# EasyEDA schematic SCH_u2-SX Mini2 - AC608 IO Board v0.1_2024-04-02.json

## Sheets
1 Core: TITLE: Sheet_1; REV: 1.0; Date: 2024-03-23; Sheet: 1/1; Drawn By: Denjhang; Company: Your Company
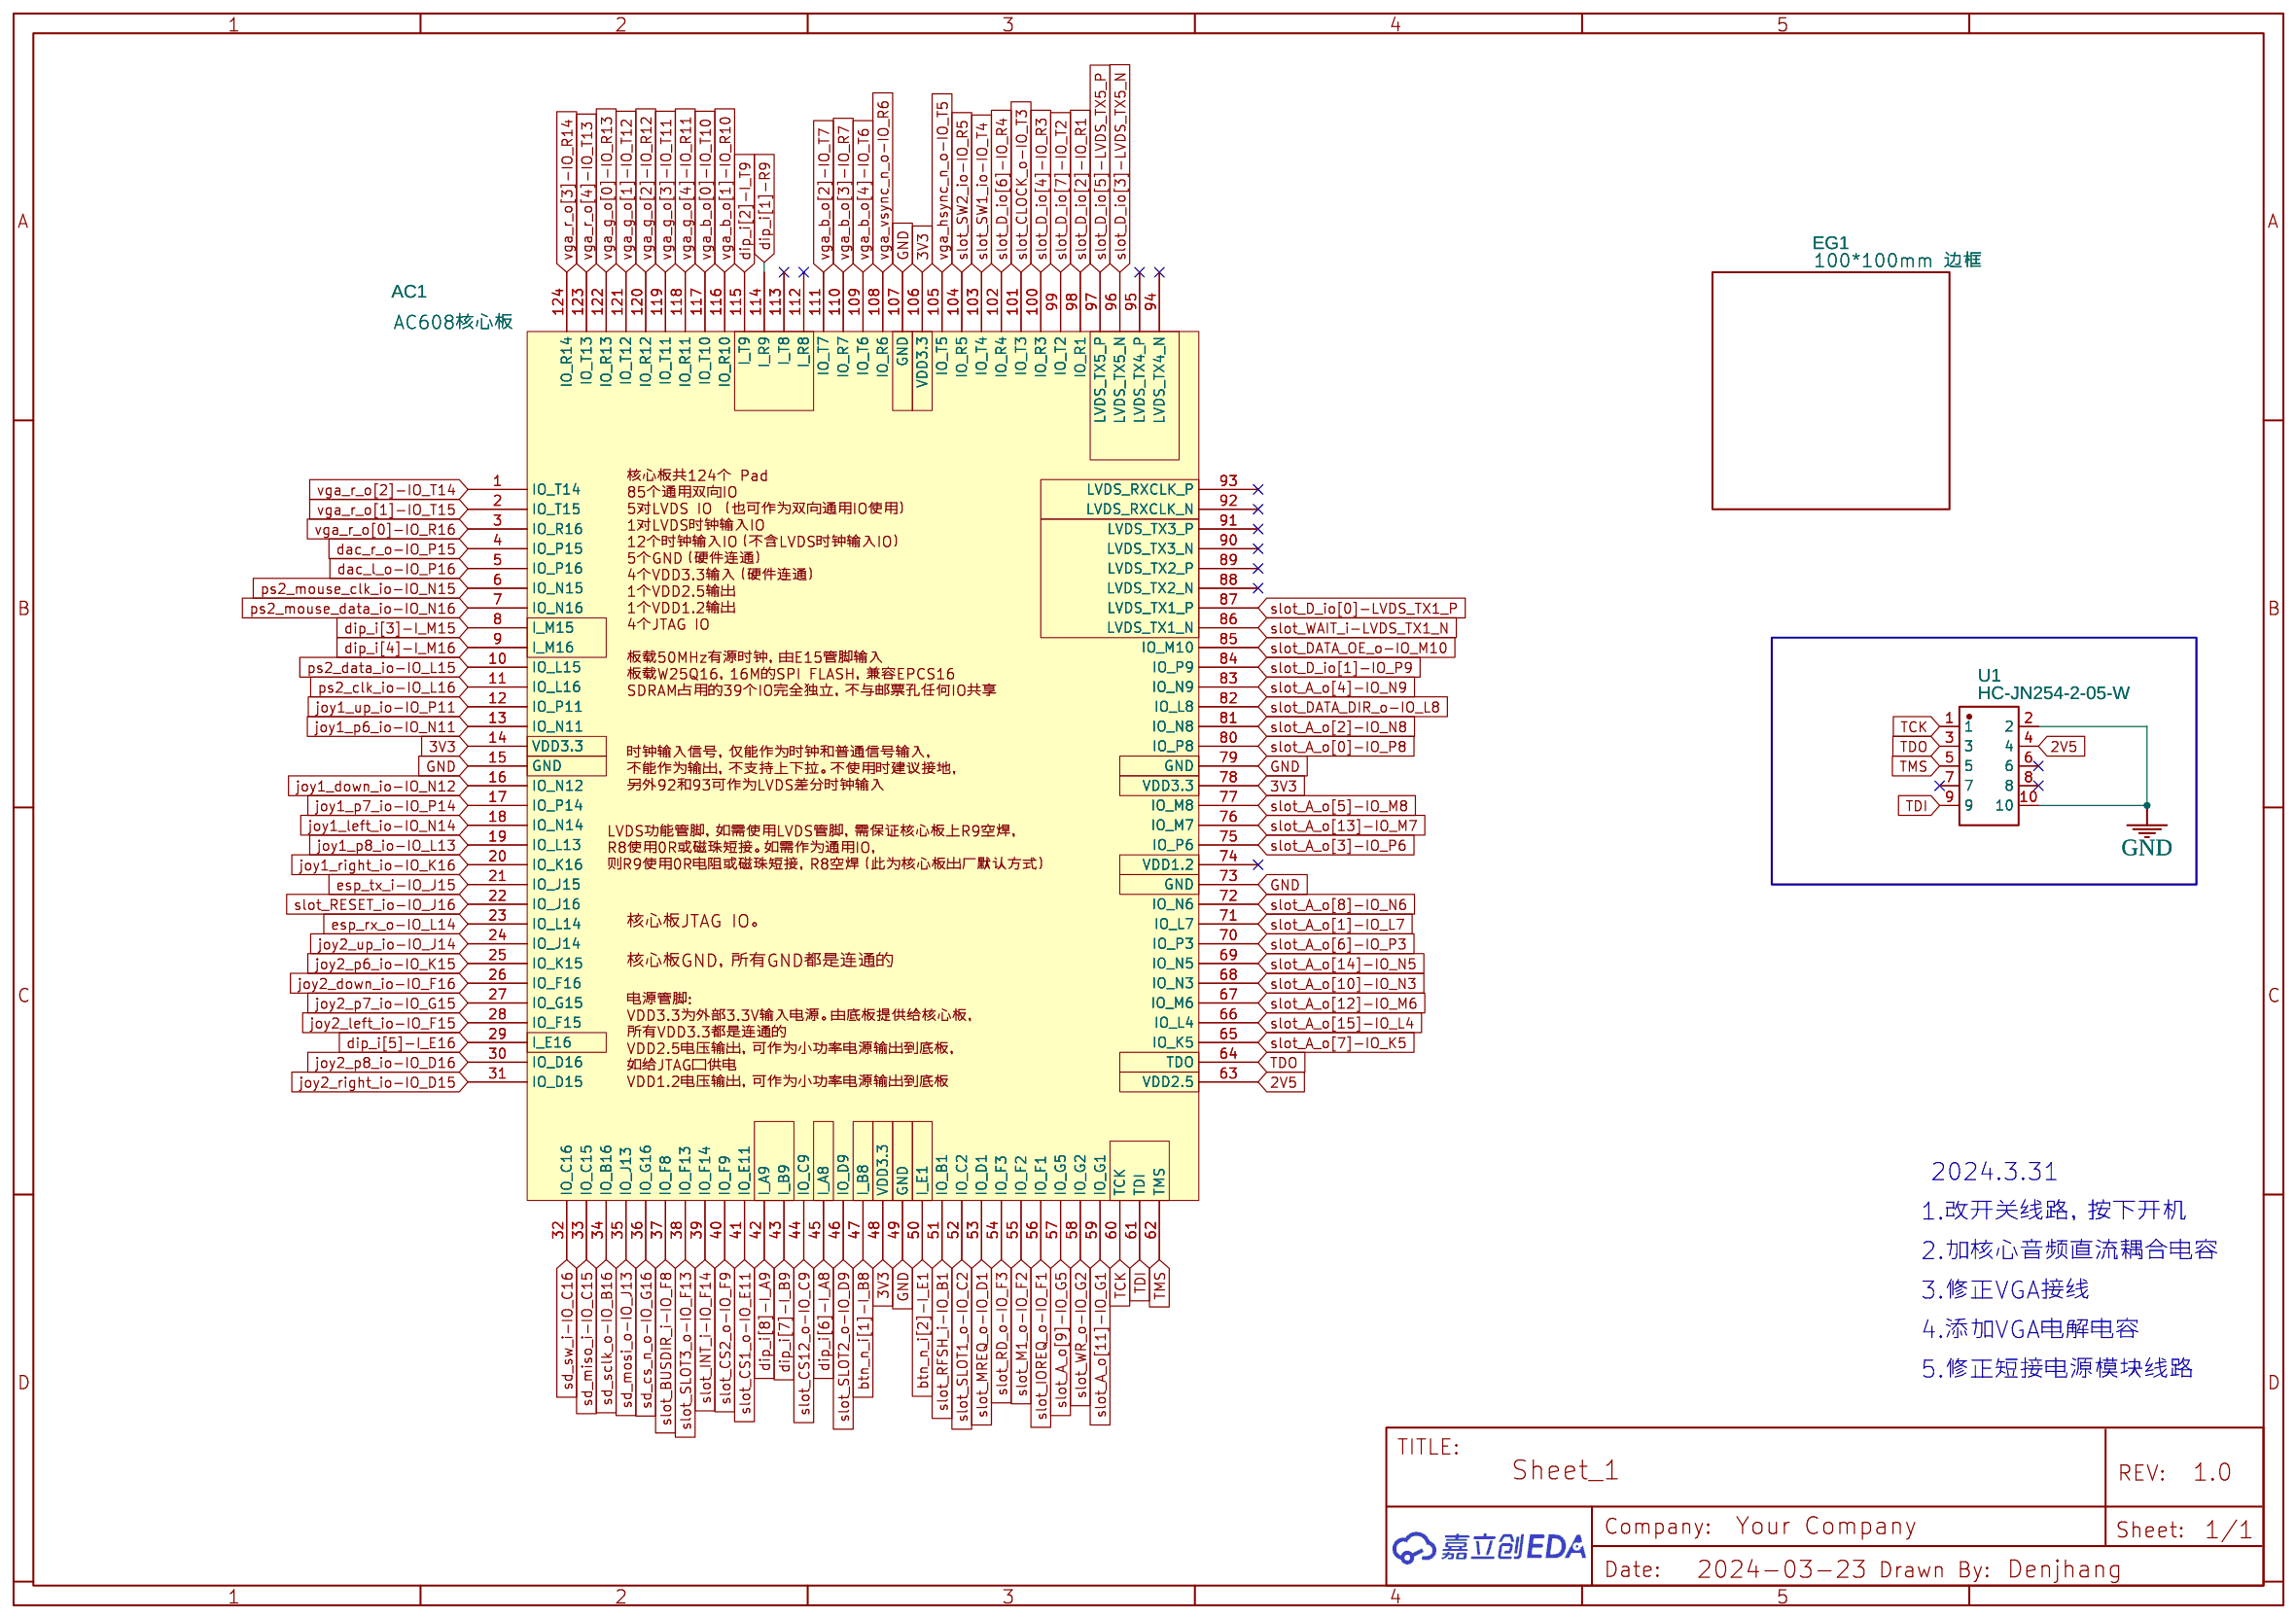
[diagram p0: Core]
2 PSU
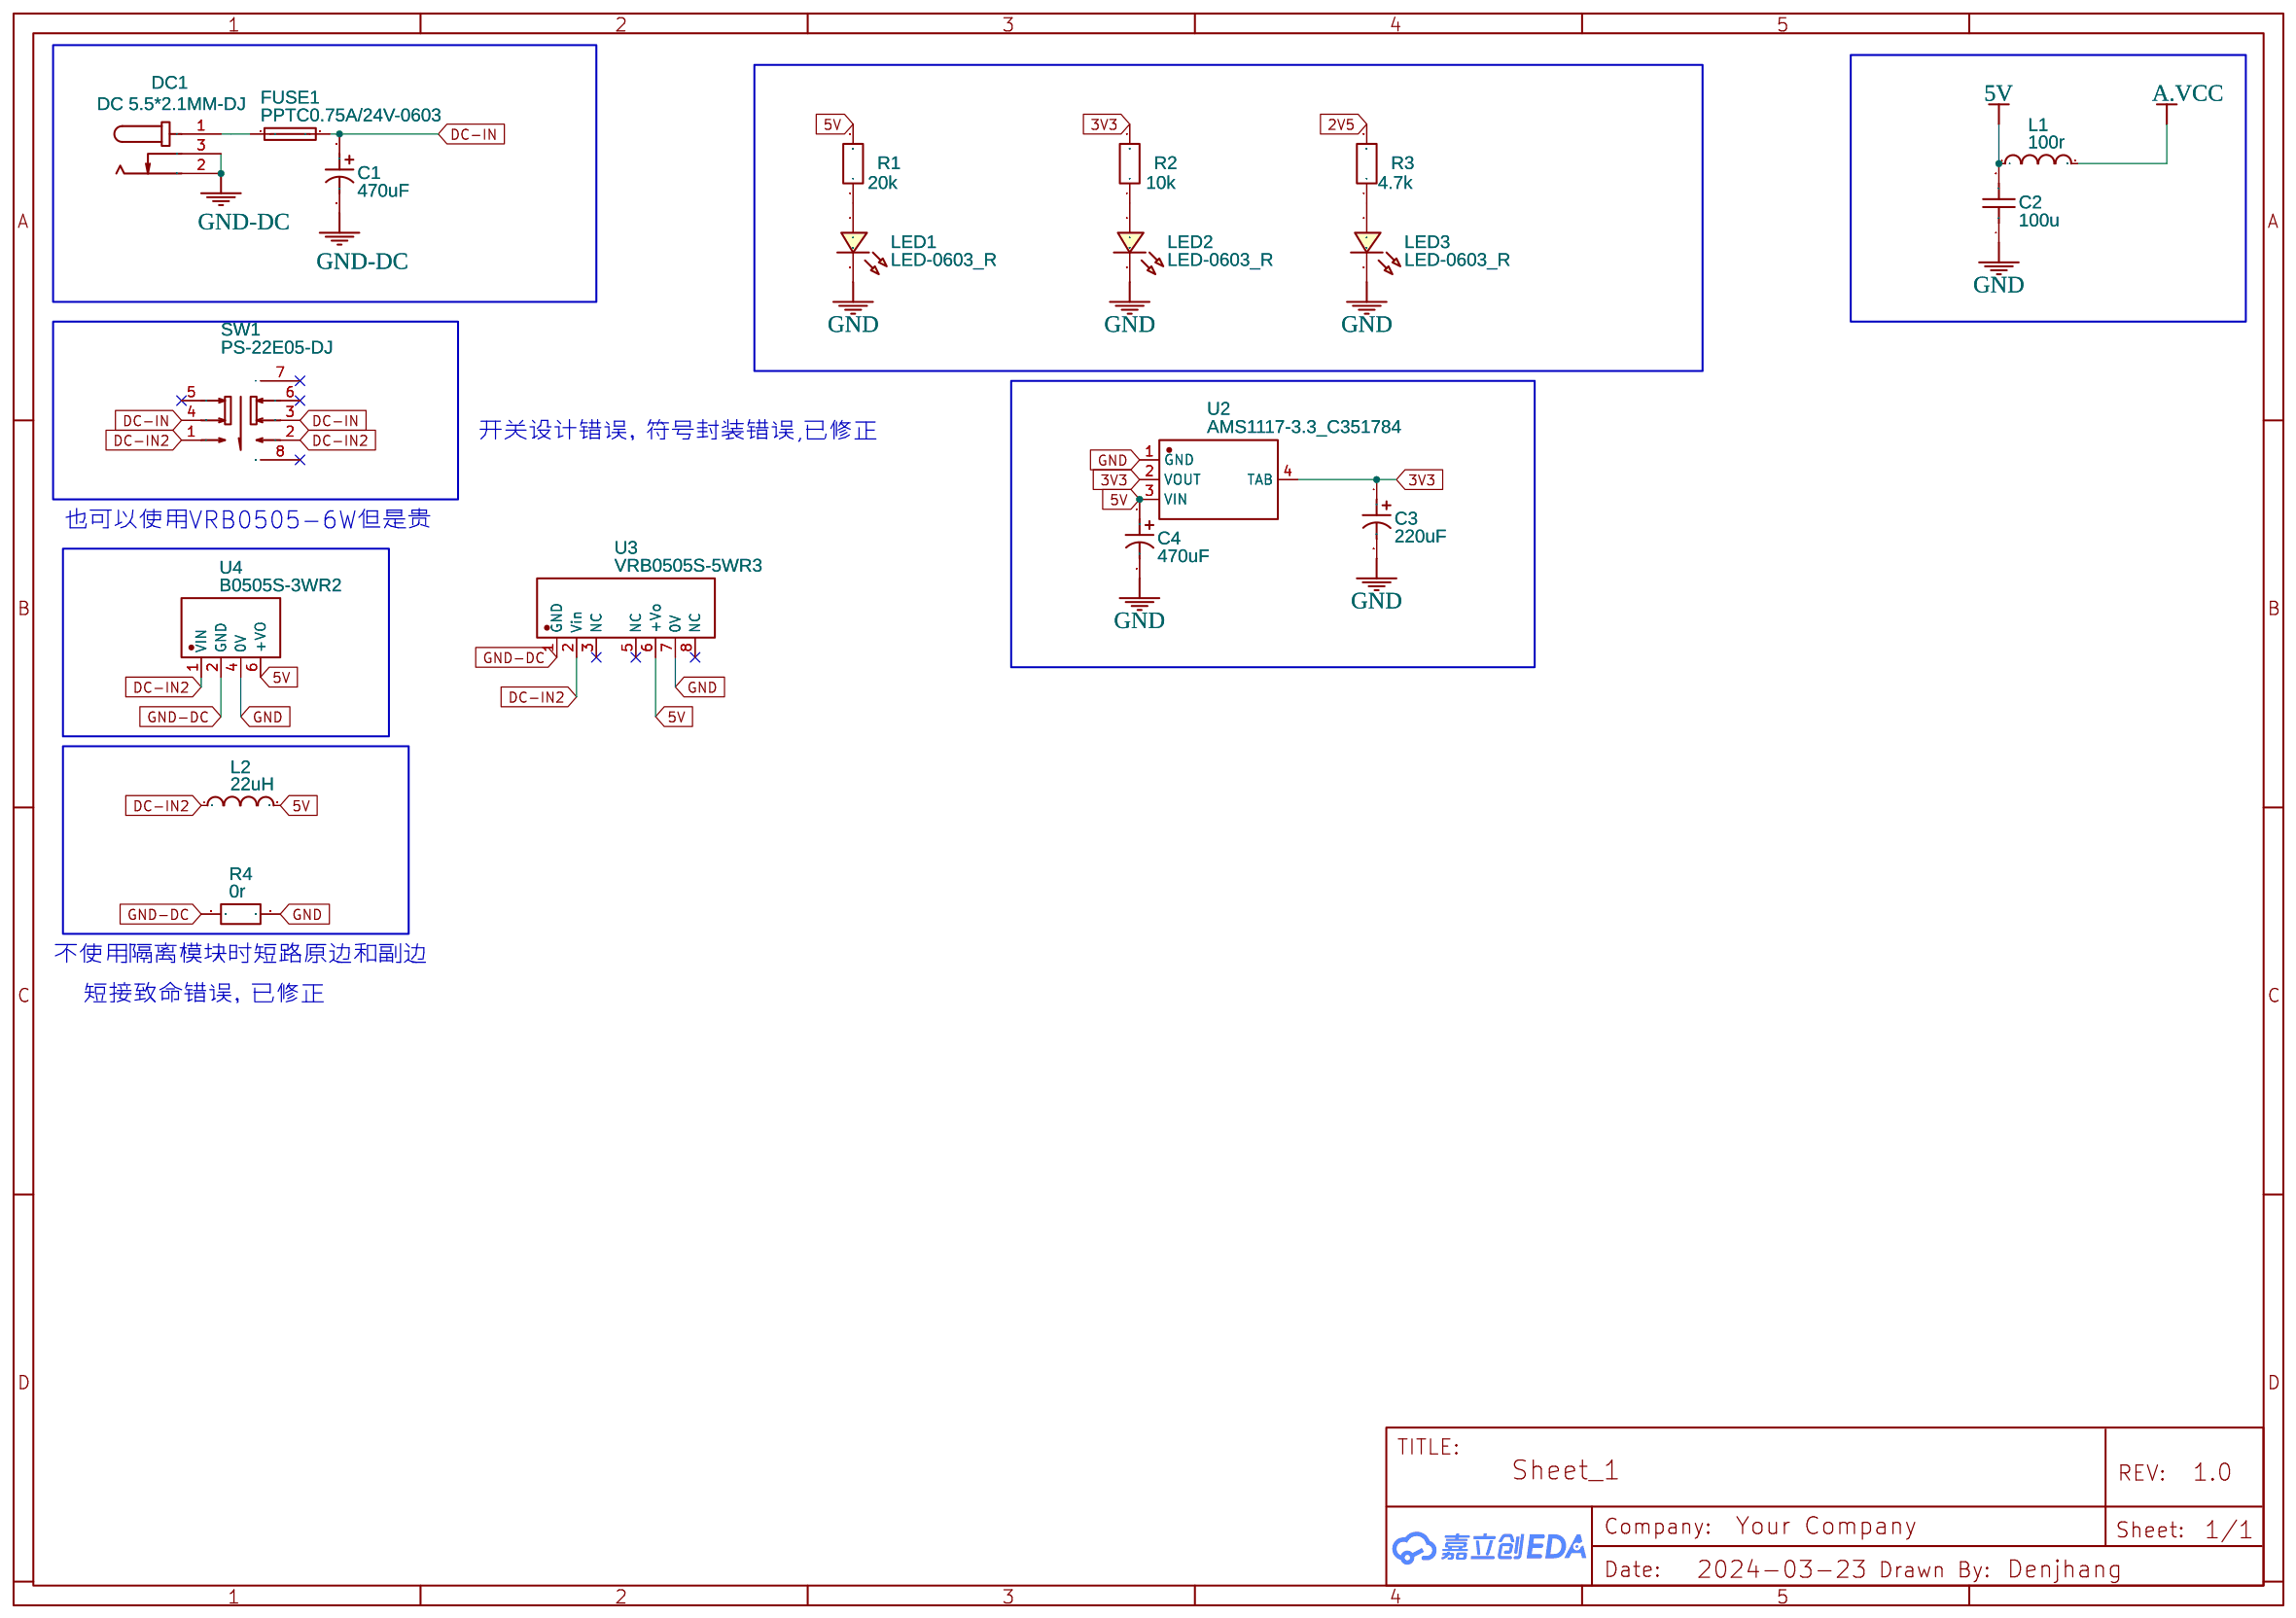
[diagram p1: PSU]
3 PORT
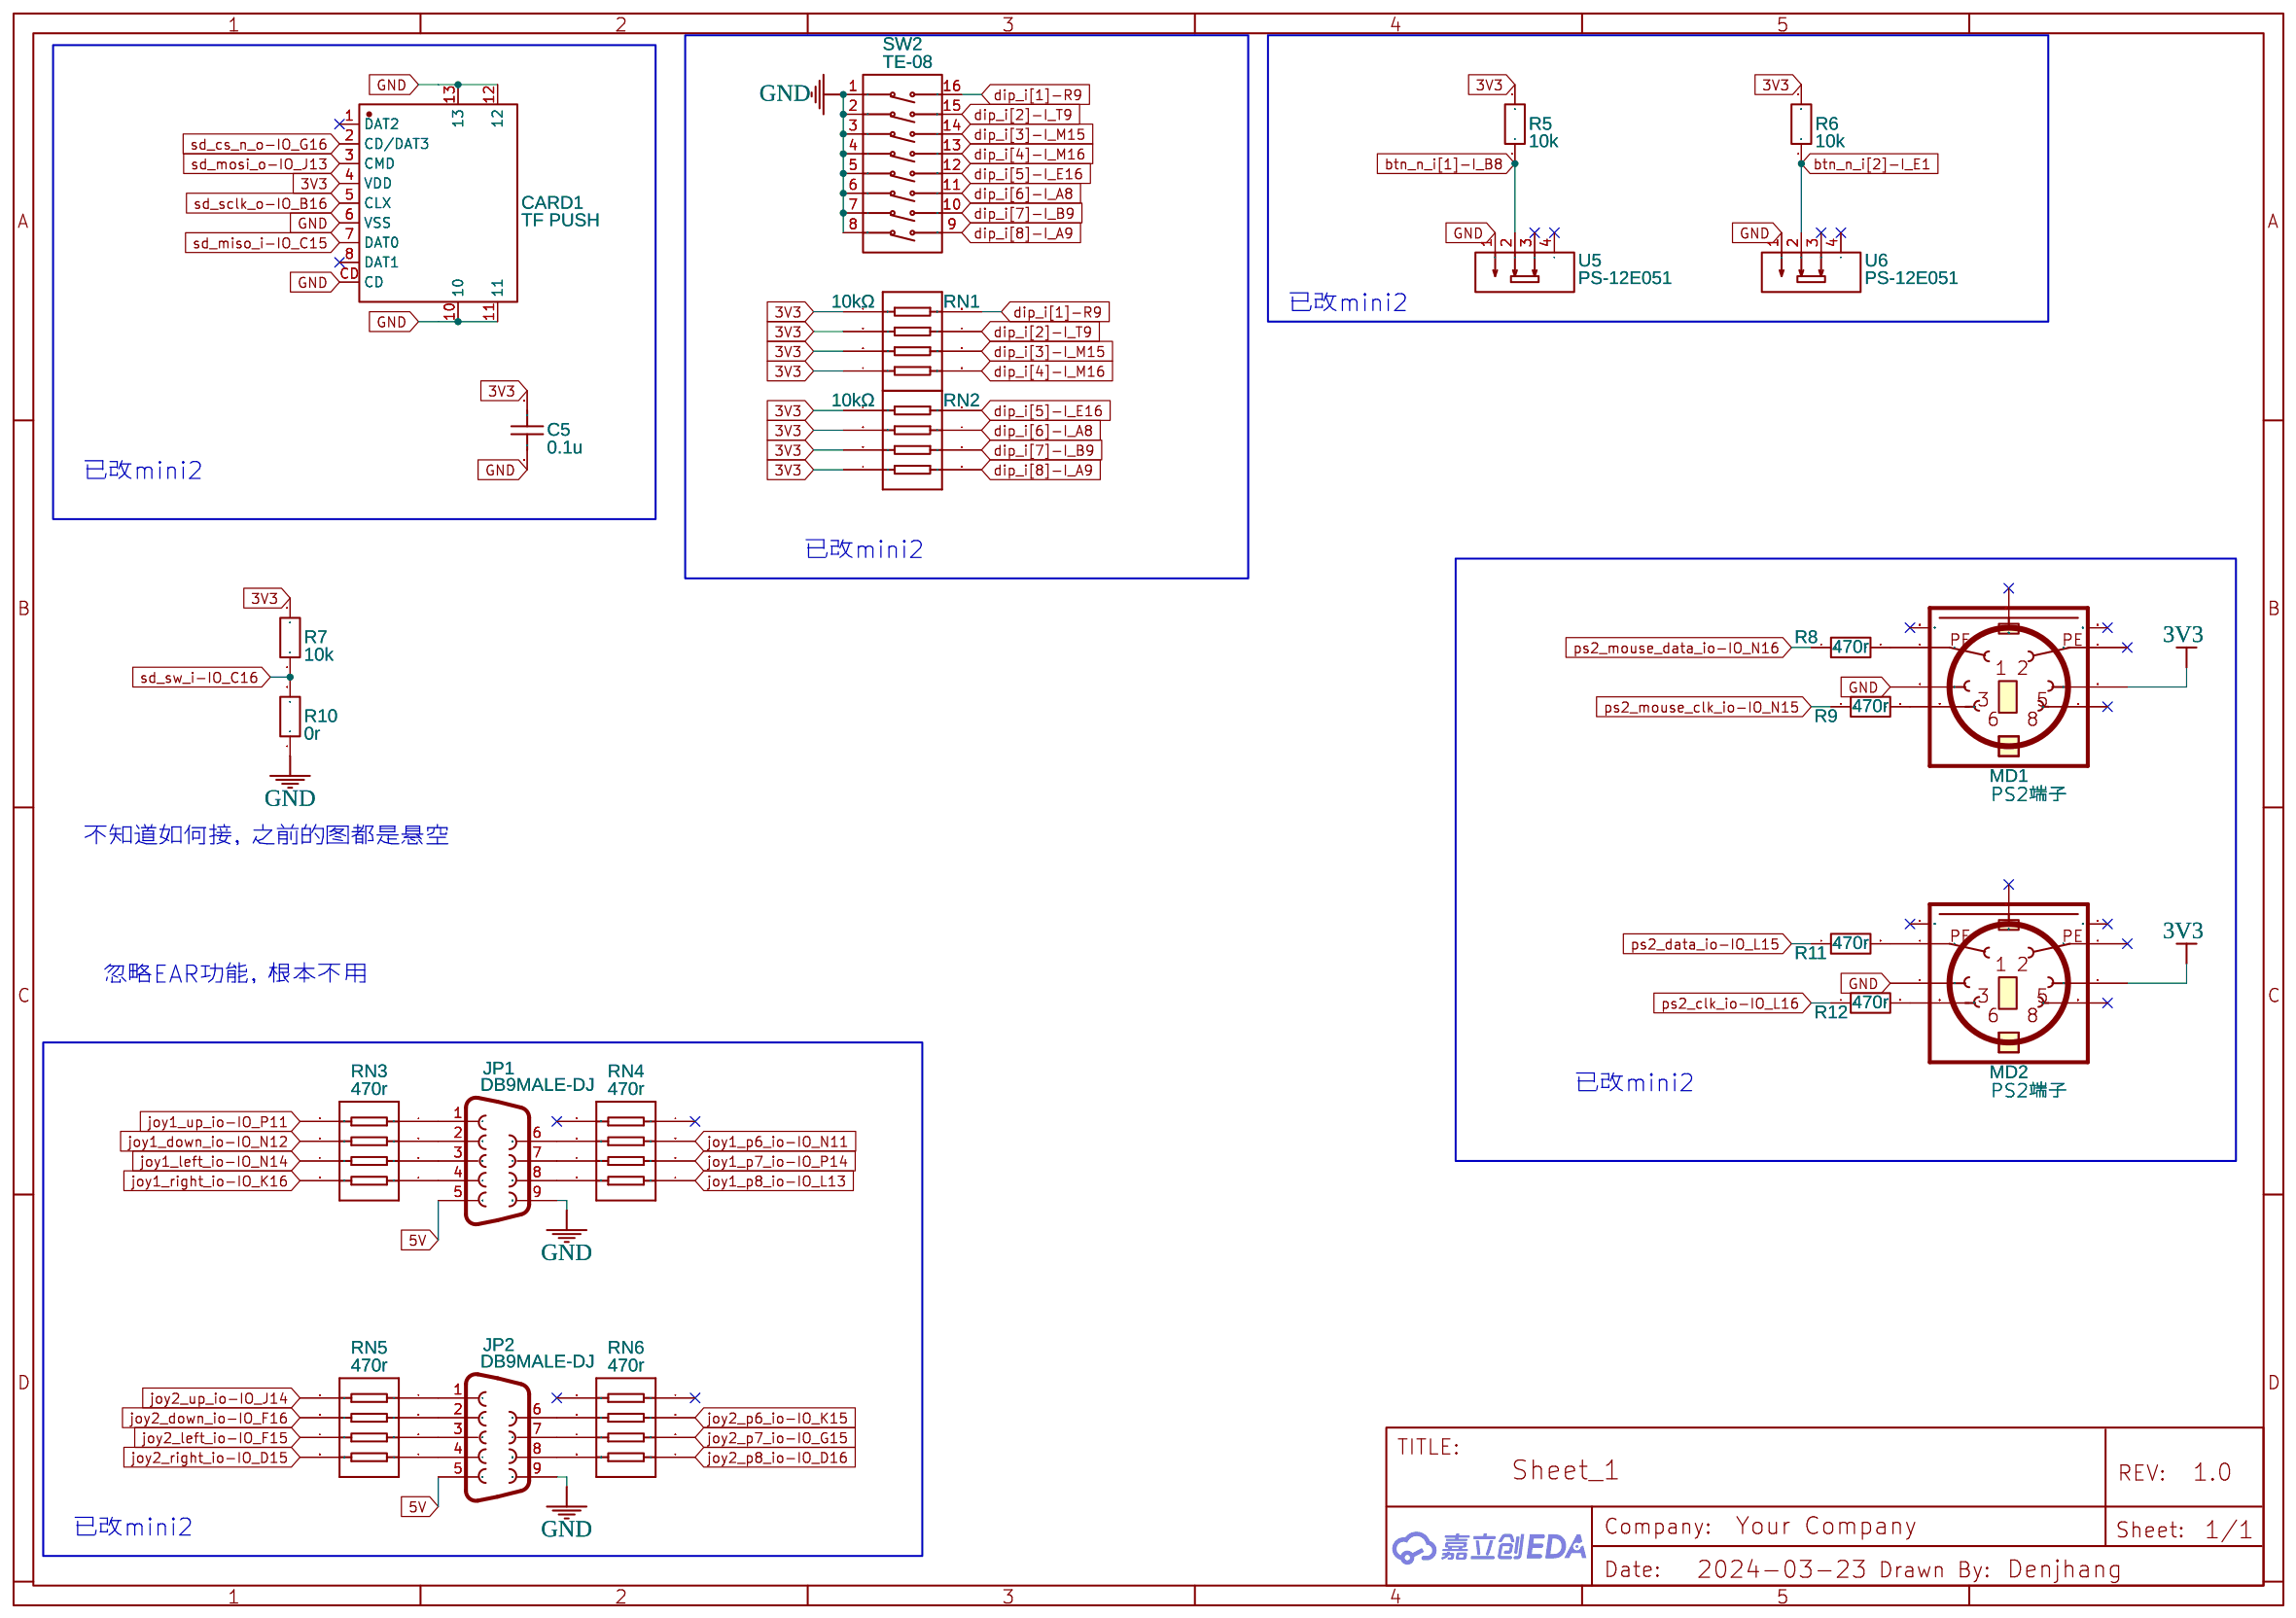
[diagram p2: PORT]
4 VGA: Date: 2024-03-24
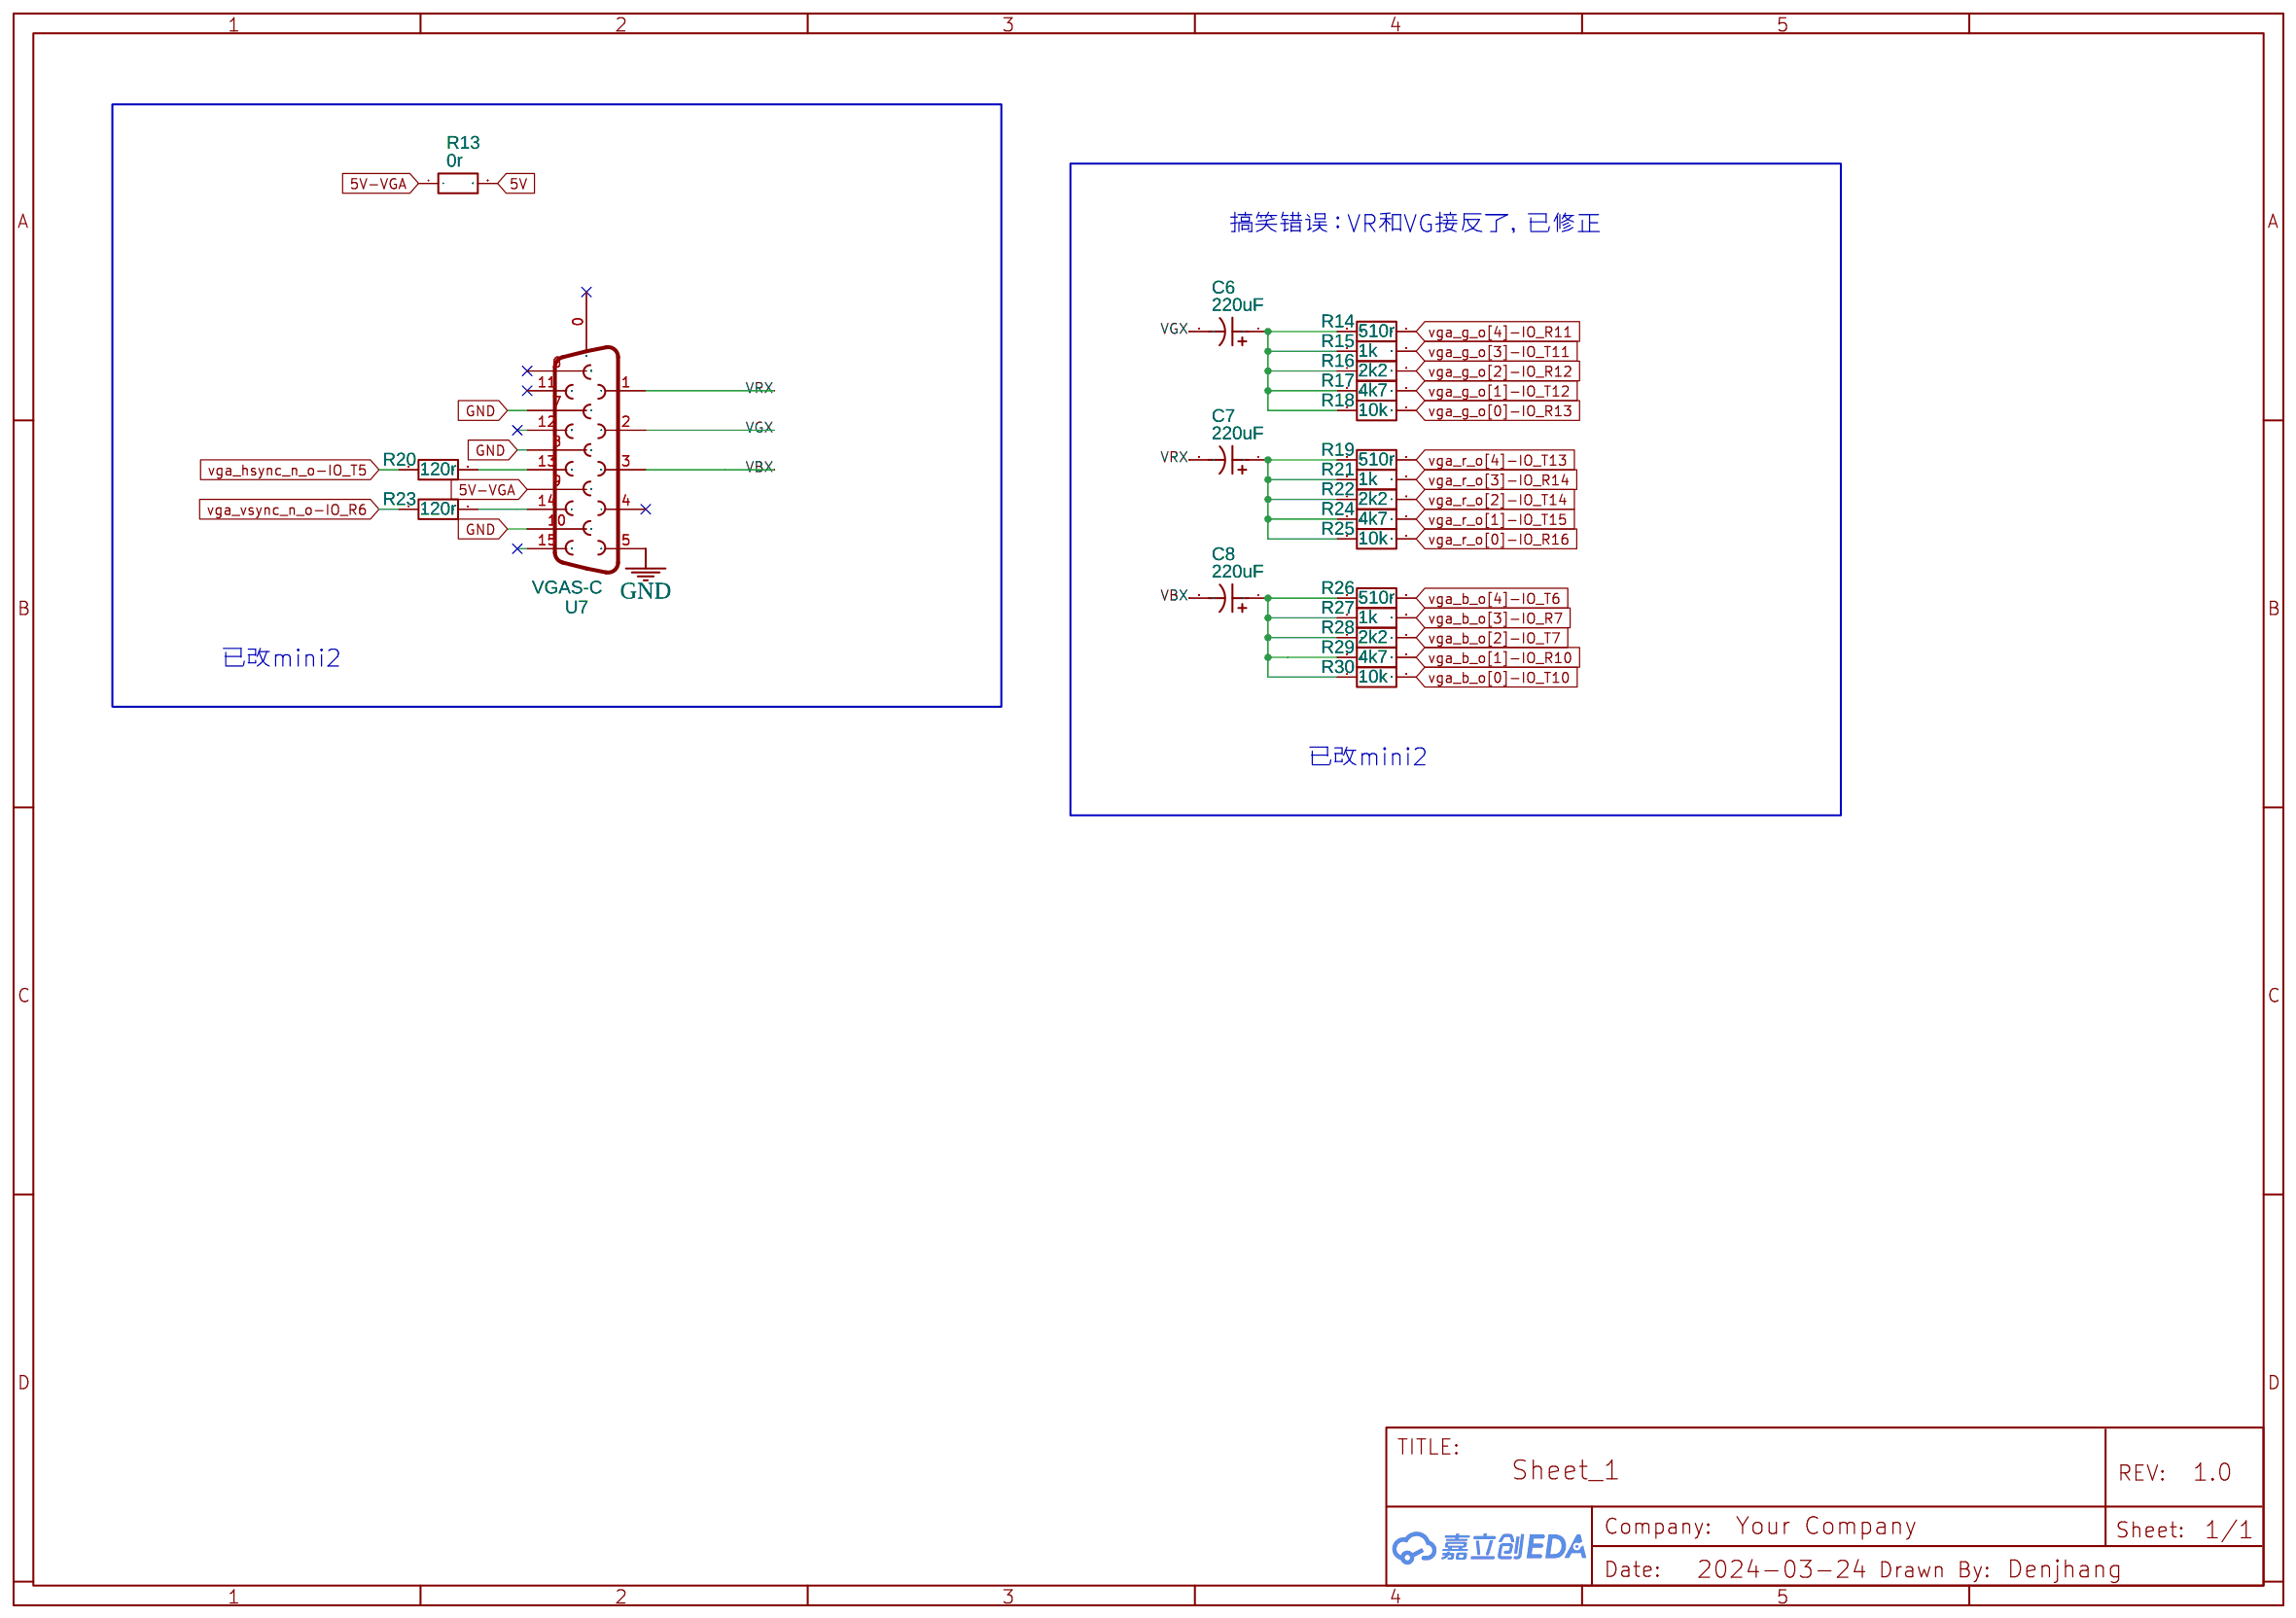
[diagram p3: VGA]
5 AUDIO: Date: 2024-03-24
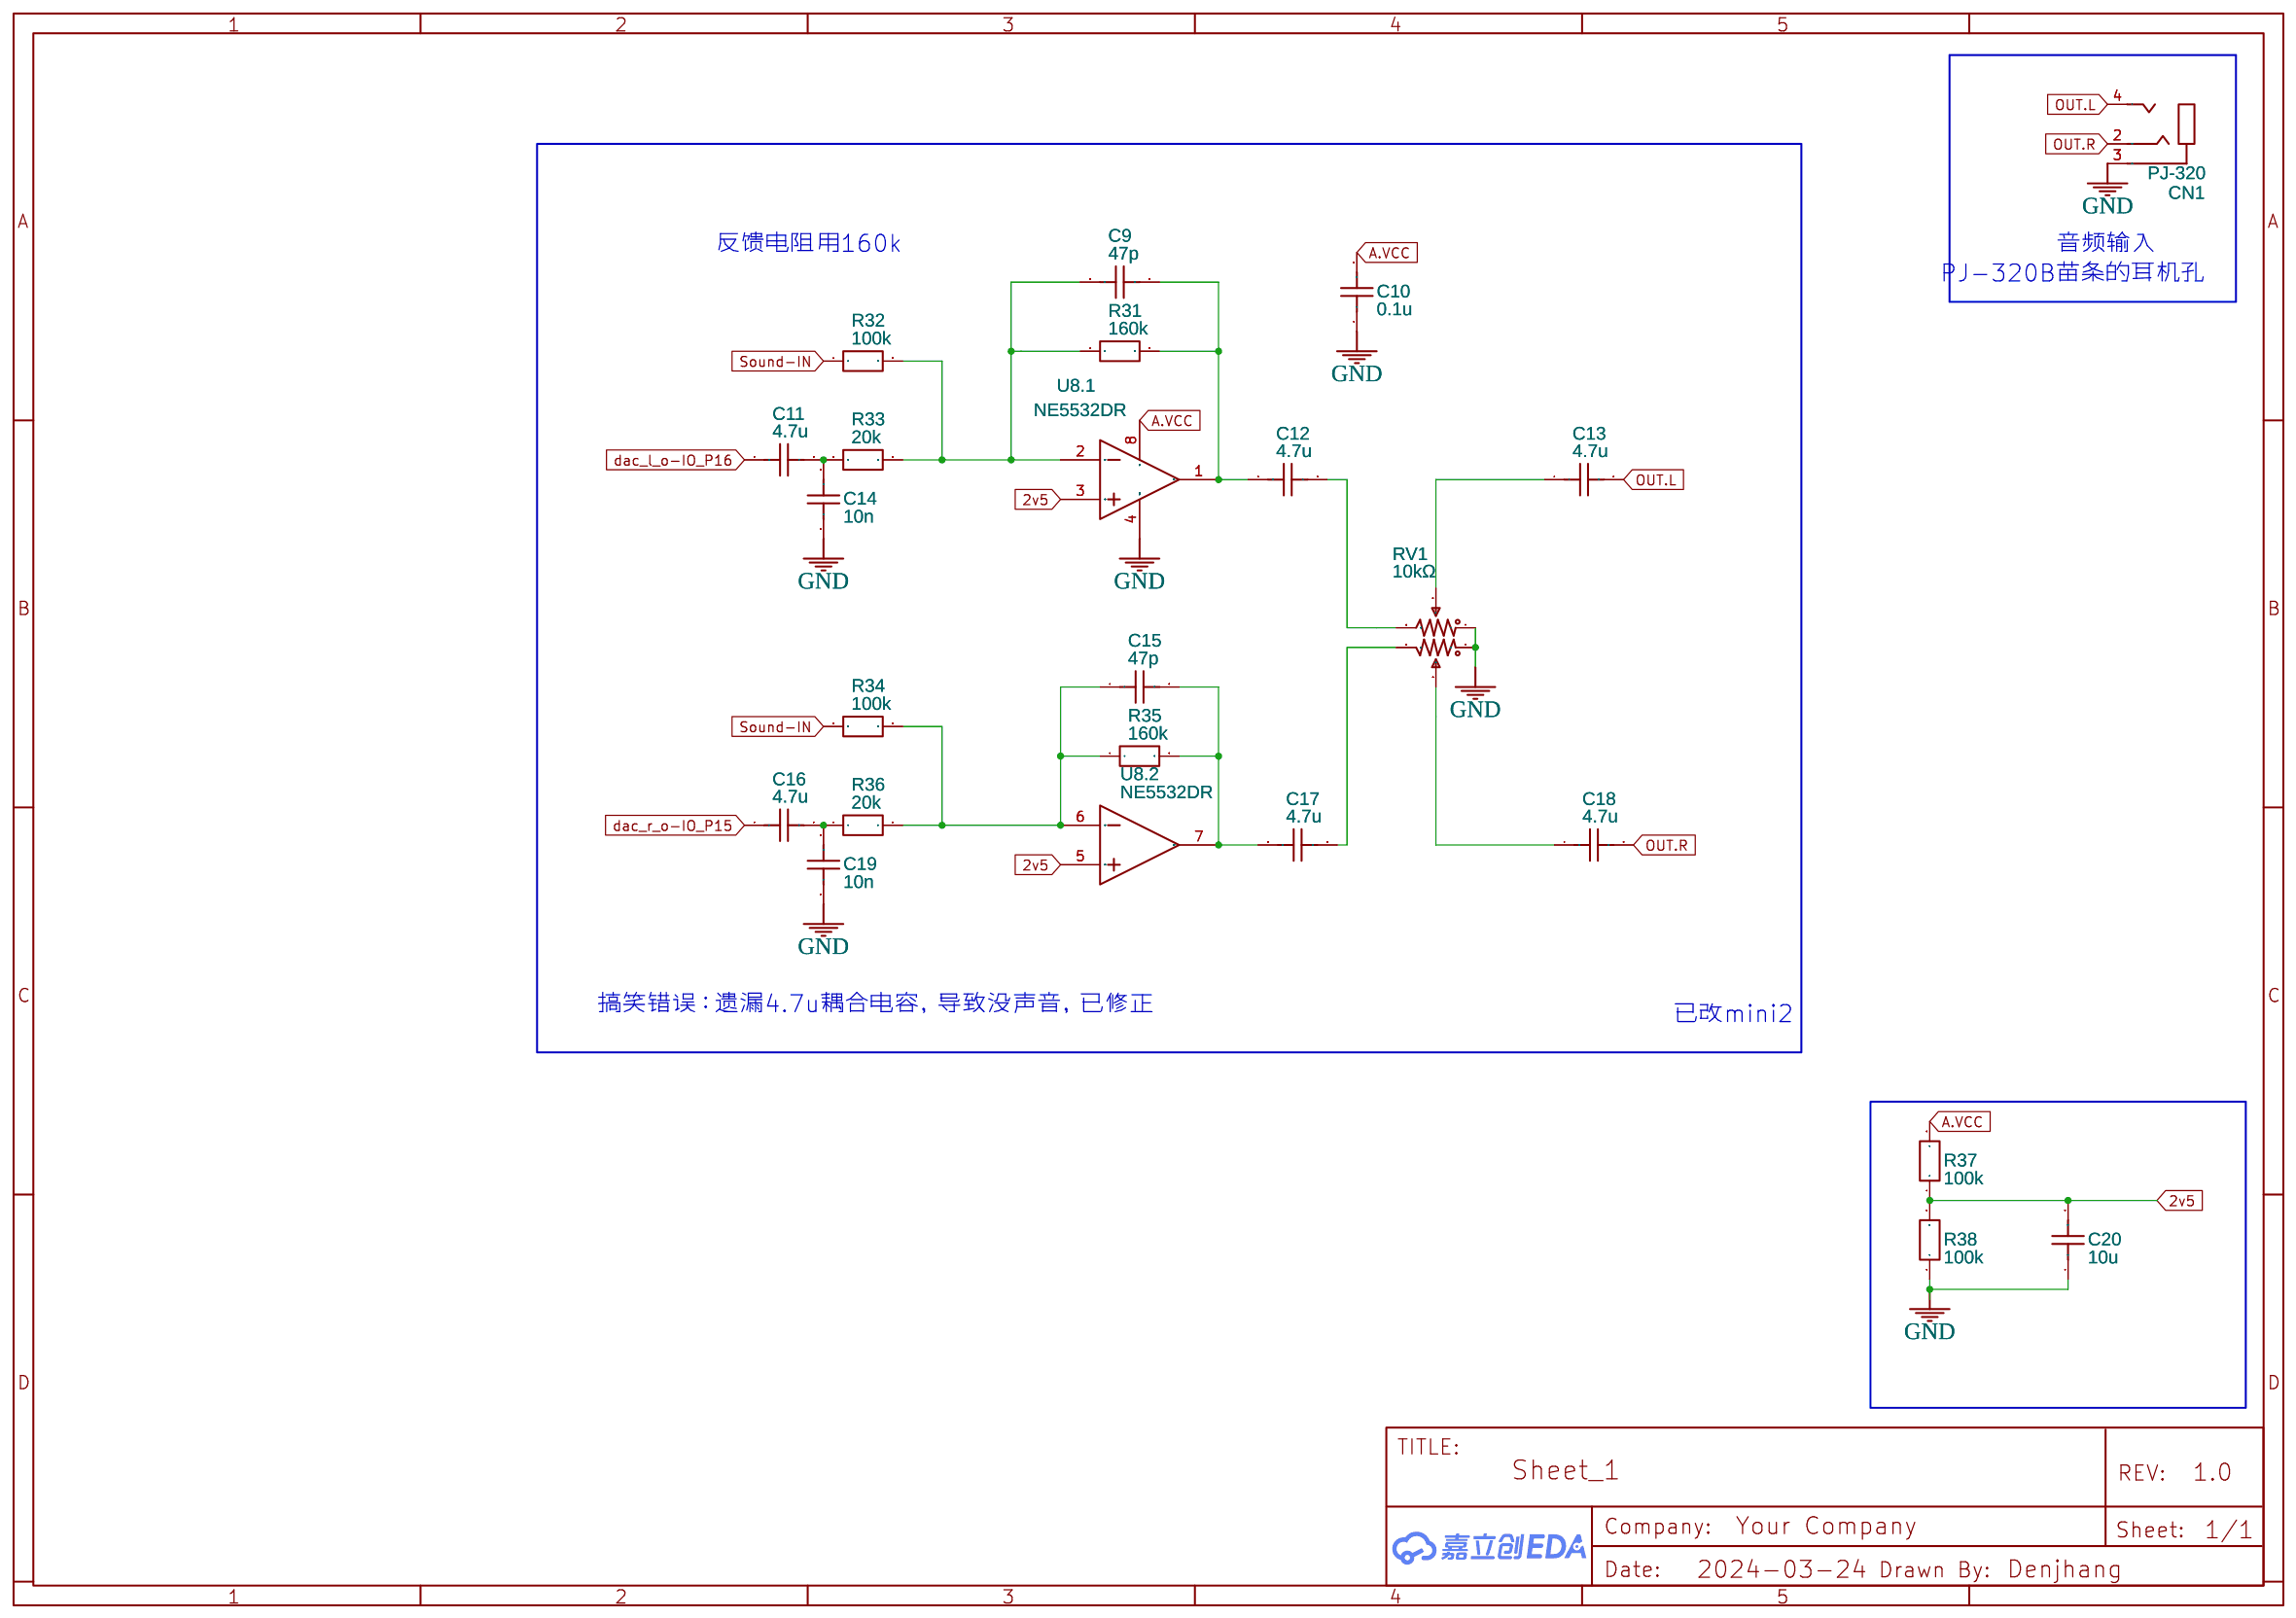
[diagram p4: AUDIO]
6 SLOT: Date: 2024-03-24
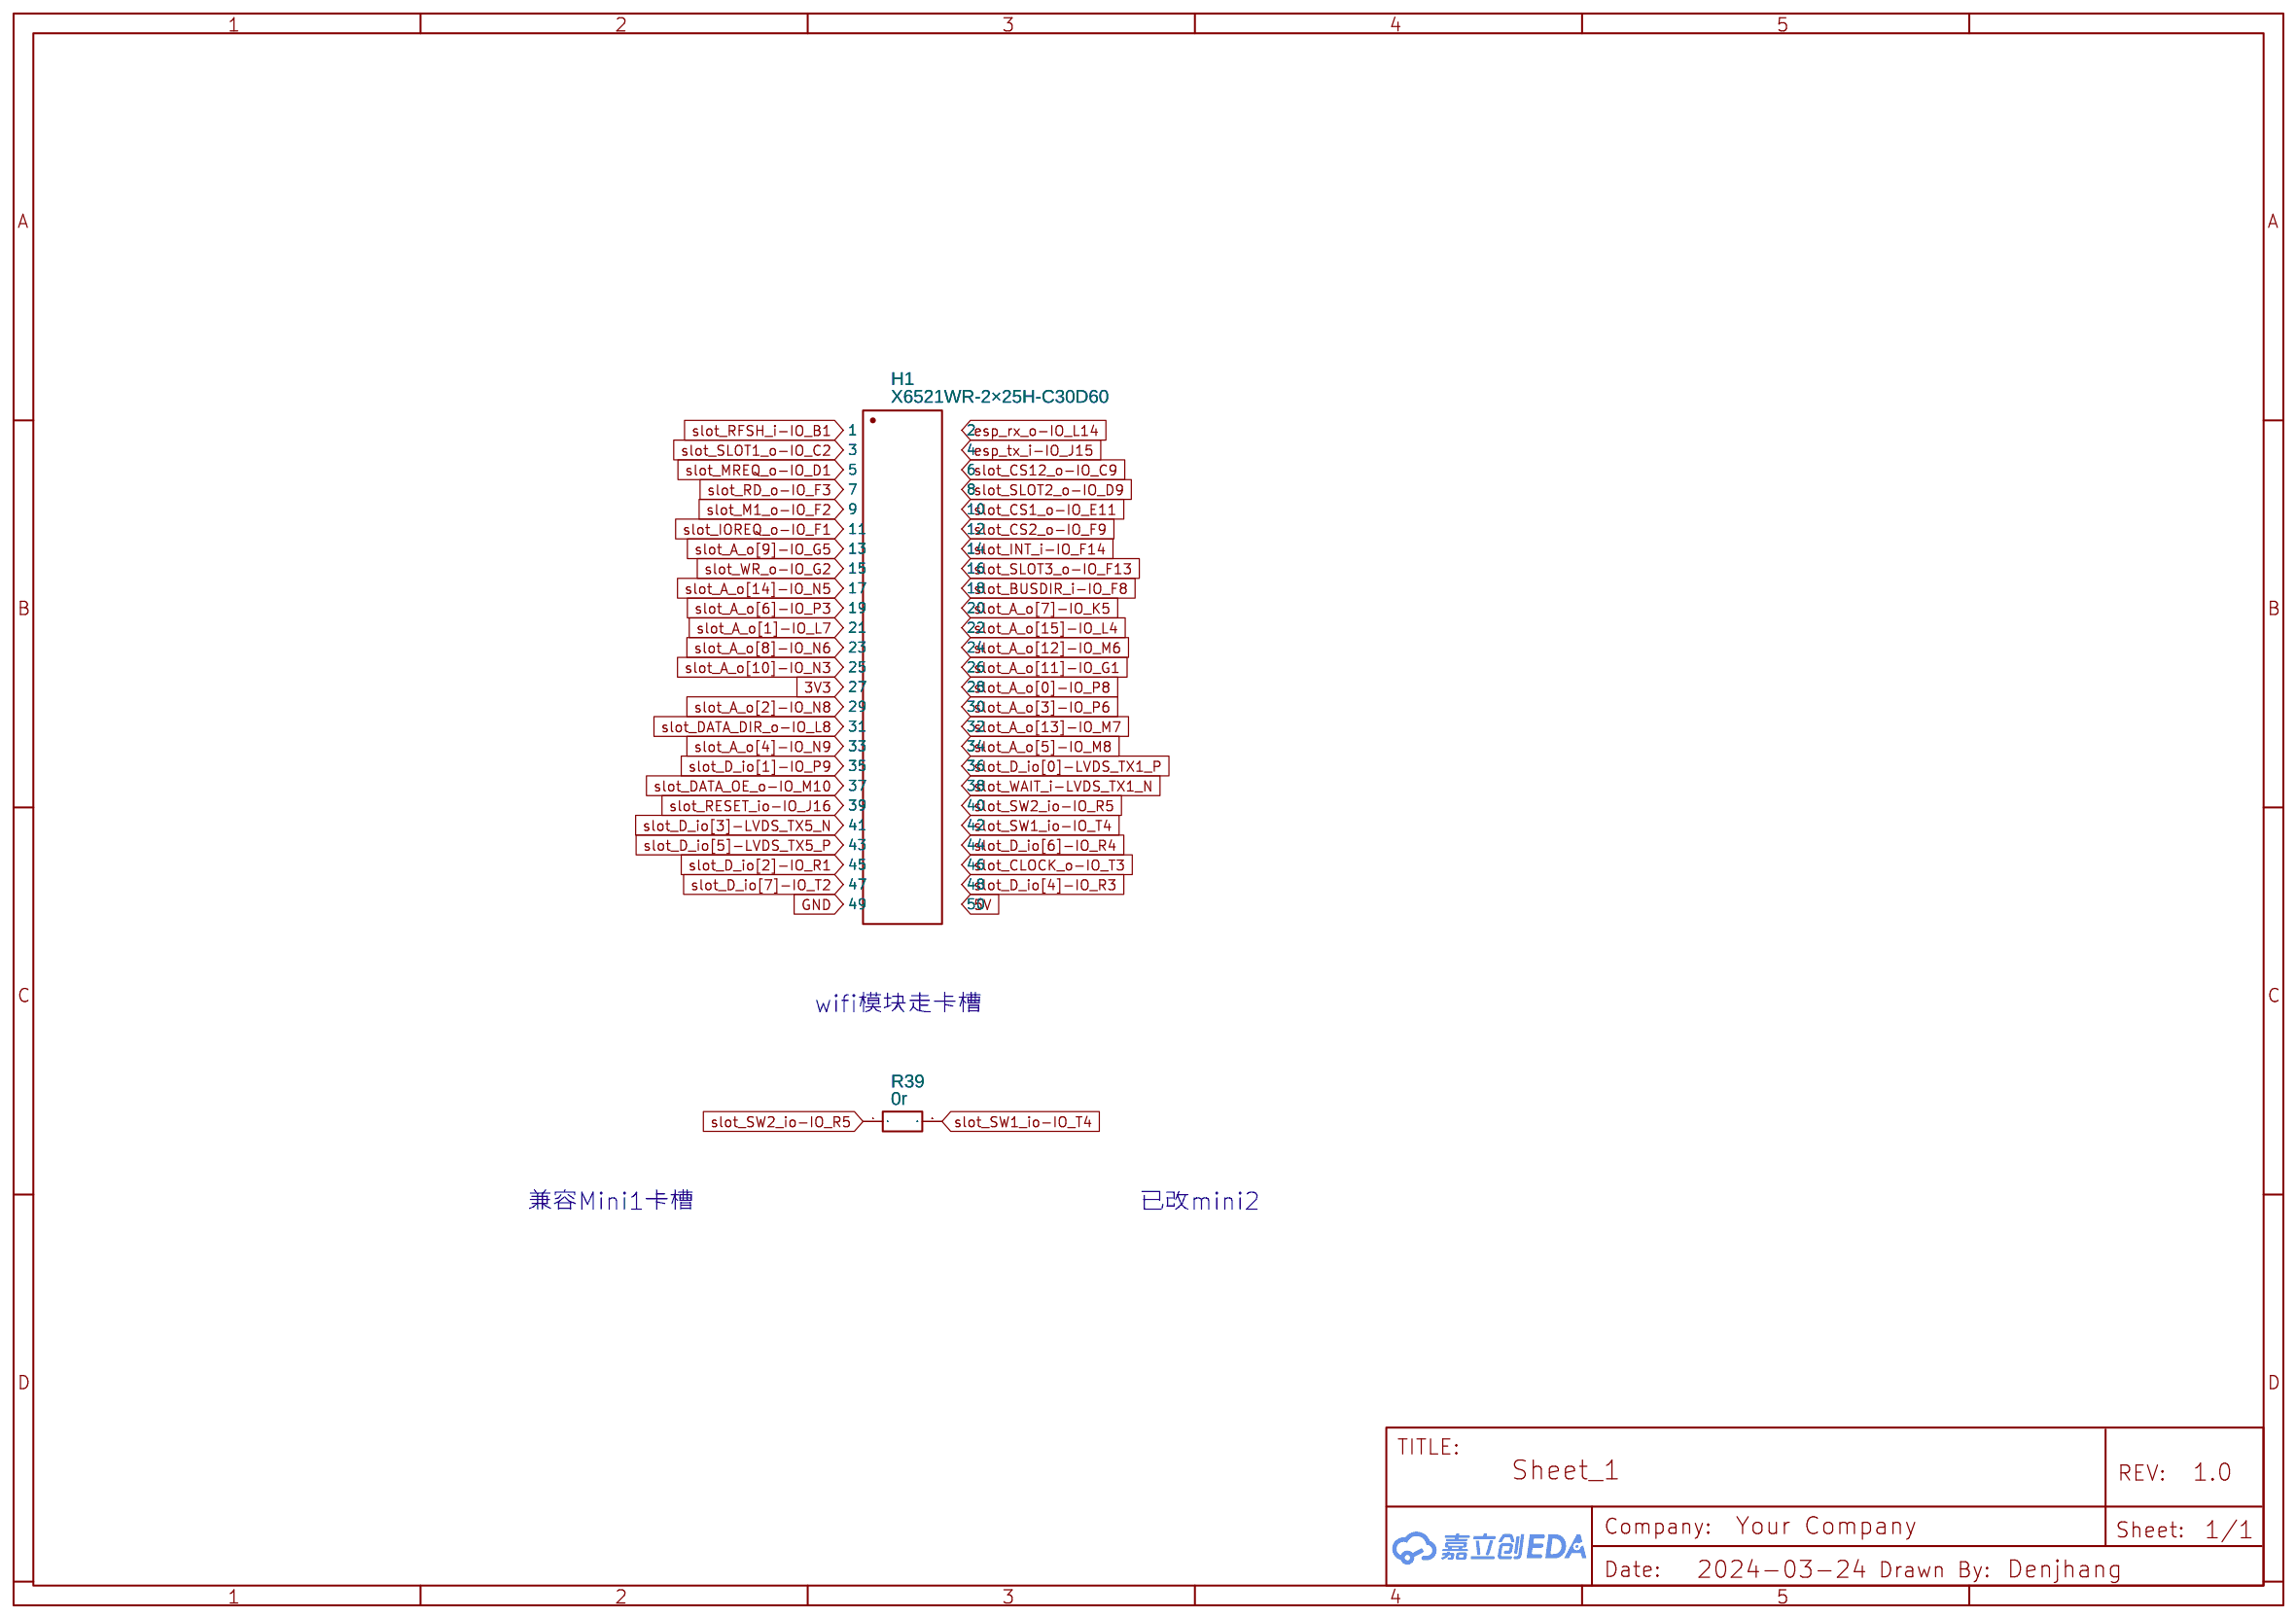
[diagram p5: SLOT]

## Parts
sheet AUDIO
C9  47p  [C0603]
C10  0.1u  [C0603]
C11  4.7u  [C0603]
C12  4.7u  [C0603]
C13  4.7u  [C0603]
C14  10n  [C0603]
C15  47p  [C0603]
C16  4.7u  [C0603]
C17  4.7u  [C0603]
C18  4.7u  [C0603]
C19  10n  [C0603]
C20  10u  [C0603]
CN1  PJ-320  [AUDIO-TH_HOOYA_PJ-320]
R31  160k  [R0603]
R32  100k  [R0603]
R33  20k  [R0603]
R34  100k  [R0603]
R35  160k  [R0603]
R36  20k  [R0603]
R37  100k  [R0603]
R38  100k  [R0603]
RV1  10kΩ  [RK097G-DJ]
U8  NE5532DR  [SOIC-8_L4.9-W3.9-P1.27-LS6.0-BL]  (sections 1,2)
sheet Core
AC1  AC608核心板  [AC608核心板]
EG1  100*100mm 边框  [100*100MM 边框]
U1  HC-JN254-2-05-W  [HDR-TH_10P-P2.54-H-F-R2-C5-W9.0]
sheet PORT
C5  0.1u  [C0603]
CARD1  TF PUSH  [TF-SMD_TF-PUSH]
JP1  DB9MALE-DJ  [DB9MALE-DJ]
JP2  DB9MALE-DJ  [DB9MALE-DJ]
MD1  PS2端子  [M_DIN6-DJ]
MD2  PS2端子  [M_DIN6-DJ]
R5  10k  [R0603]
R6  10k  [R0603]
R7  10k  [R0603]
R8  470r  [R0603]
R9  470r  [R0603]
R10  0r  [R0603]
R11  470r  [R0603]
R12  470r  [R0603]
RN1  10kΩ  [RES-ARRAY-SMD_0603-8P-L3.2-W1.6-BL]
RN2  10kΩ  [RES-ARRAY-SMD_0603-8P-L3.2-W1.6-BL]
RN3  470r  [RES-ARRAY-SMD_0603-8P-L3.2-W1.6-BL]
RN4  470r  [RES-ARRAY-SMD_0603-8P-L3.2-W1.6-BL]
RN5  470r  [RES-ARRAY-SMD_0603-8P-L3.2-W1.6-BL]
RN6  470r  [RES-ARRAY-SMD_0603-8P-L3.2-W1.6-BL]
SW2  TE-08  [SW-TH_TE-08]
U5  PS-12E051  [SW-TH_PS-12E051XX]
U6  PS-12E051  [SW-TH_PS-12E051XX]
sheet PSU
C1  470uF  [CAP-SMD_BD6.3-L6.6-W6.6-FD]
C2  100u  [C1206]
C3  220uF  [CAP-SMD_BD6.3-L6.6-W6.6-FD]
C4  470uF  [CAP-SMD_BD6.3-L6.6-W6.6-FD]
DC1  DC 5.5*2.1MM-DJ  [DC-IN-TH_HX-DC005-2.5-DJ]
FUSE1  PPTC0.75A/24V-0603  [F0603]
L1  100r  [L0603]
L2  22uH  [IND-SMD_L4.4-W4.0_PHC0420]
LED1  LED-0603_R  [LED0603_RED]
LED2  LED-0603_R  [LED0603_RED]
LED3  LED-0603_R  [LED0603_RED]
R1  20k  [R0603]
R2  10k  [R0603]
R3  4.7k  [R0603]
R4  0r  [R0603]
SW1  PS-22E05-DJ  [SW-TH_PS-22E05]
U2  AMS1117-3.3_C351784  [SOT-223-3_L6.5-W3.4-P2.30-LS7.0-BR]
U3  VRB0505S-5WR3  [PWRM-TH_7P-L22.0-W9.5-P2.54_VRB0505S-5WR3]
U4  B0505S-3WR2  [PWRM-TH_B0505S-3WR2]
sheet SLOT
H1  X6521WR-2×25H-C30D60  [HDR-TH_50P-P2.54-H-M-R2-C25-S2.54]
R39  0r  [R0603]
sheet VGA
C6  220uF  [CAP-SMD_BD6.3-L6.6-W6.6-FD]
C7  220uF  [CAP-SMD_BD6.3-L6.6-W6.6-FD]
C8  220uF  [CAP-SMD_BD6.3-L6.6-W6.6-FD]
R13  0r  [R0603]
R14  510r  [R0603]
R15  1k  [R0603]
R16  2k2  [R0603]
R17  4k7  [R0603]
R18  10k  [R0603]
R19  510r  [R0603]
R20  120r  [R0603]
R21  1k  [R0603]
R22  2k2  [R0603]
R23  120r  [R0603]
R24  4k7  [R0603]
R25  10k  [R0603]
R26  510r  [R0603]
R27  1k  [R0603]
R28  2k2  [R0603]
R29  4k7  [R0603]
R30  10k  [R0603]
U7  VGAS-C  [DB15-TH_FDB1519-F0DB300U1KA]

## Library data of the parts
C5 C9-C20 = C_0603_US: Contributor: LCEDA_Lib
CN1 = PJ-320: Supplier: LCSC; Supplier Part: C2939180; Manufacturer: HOOYA(皓宇电子); Contributor: LCSC; JLCPCB Part Class: Extended Part
R1-R39 = R_0603_EU: Contributor: LCEDA_Lib
RV1 = RK097-双连体: Contributor: LCSC; Supplier: LCSC; Supplier Part: C231763; Manufacturer: ALPSALPINE(阿尔卑斯阿尔派); Manufacturer Part: RK09712200MY; JLCPCB Part Class: Extended Part
U8 = NE5532DR: image: //image.lceda.cn/szlcsc/C7426.jpg; SMT Type: Basic; subpart_no: 2; Supplier: LCSC; Manufacturer: TI(德州仪器); LCSC Assembly: Yes; Supplier Part: C7426; JLCPCB Part Class: Basic Part; link: https://so.szlcsc.com/global.html?k=C7426&ref=editor
AC1 = AC608核心板: Contributor: denjhang
EG1 = 100*100mm 边框: Contributor: Denjhang
U1 = HC-JN254-2-05-W: Contributor: lcsc; Supplier: LCSC; Supplier Part: C5372873; Manufacturer: HCTL(华灿天禄); JLCPCB Part Class: Extended Part; link: https://so.szlcsc.com/global.html?k=C5372873&ref=editor
CARD1 = TF PUSH: Contributor: LCSC; Supplier: LCSC; Supplier Part: C393941; Manufacturer: SHOU HAN(首韩); JLCPCB Part Class: Extended Part; link: https://so.szlcsc.com/global.html?k=C393941&ref=editor
JP1 JP2 = DB9MALE-DJ: DB9 Connector; Contributor: SparkFun
MD1 MD2 = PS2端子: Contributor: LCSC; Supplier: LCSC; Supplier Part: C2926814; Manufacturer: 华宇创; Manufacturer Part: HYC03-MDC603-128B; JLCPCB Part Class: Extended Part
RN1-RN6 = RC-ML08W103JT: Contributor: LCSC; Supplier: LCSC; Manufacturer: FH(风华); Supplier Part: C69593; JLCPCB Part Class: Extended Part; link: https://so.szlcsc.com/global.html?k=C69593&ref=editor
SW2 = TE-08: Contributor: LCSC; Supplier: LCSC; Supplier Part: C559153; Manufacturer: Yuandi(元迪); JLCPCB Part Class: Extended Part; link: https://so.szlcsc.com/global.html?k=C559153&ref=editor
U5 U6 = PS-12E051: Contributor: lcsc; Supplier: LCSC; Supplier Part: C2848939; Manufacturer: G-Switch(品赞); link: https://so.szlcsc.com/global.html?k=C2848939&ref=editor
C1 C3 C4 C6-C8 = RVT220UF16V67RV0015: Contributor: LCSC; Supplier: LCSC; Supplier Part: C2887273; Manufacturer: KNSCHA(科尼盛); JLCPCB Part Class: Extended Part; link: https://so.szlcsc.com/global.html?k=C2887273&ref=editor
C2 = C_1206_US: Contributor: LCEDA_Lib
DC1 = DC 5.5*2.1MM-DJ: Supplier: LCSC; Manufacturer: HRO; Manufacturer Part: DC-005-20A; Contributor: LYMarvin; Supplier Part: C136744
FUSE1 = PPTC0.5A/24V-0603: Contributor: LCSC; Supplier: LCSC; Supplier Part: C9900007586; Manufacturer: null; Manufacturer Part: PPTC0.5A/24V 自恢复保险丝-0603; JLCPCB Part Class: Extended Part
L1 = L0603_US: Contributor: LCEDA_Lib
L2 = APH0420T2R2M: Contributor: lcsc; Supplier: LCSC; Supplier Part: C5349665; Manufacturer: APV(爱普微); JLCPCB Part Class: Extended Part; link: https://so.szlcsc.com/global.html?k=C5349665&ref=editor
LED1-LED3 = LED-0603_R: Manufacturer: EVERLIGHT(台湾亿光); Manufacturer Part: 19-217/R6C-AL1M2VY/3T; Supplier Part: C72044; Supplier: LCSC; Contributor: LCEDA_01
SW1 = PS-22E05-DJ: Contributor: Denjhang
U2 = AMS1117-3.3_C351784: Contributor: LCSC; Supplier: LCSC; Supplier Part: C351784; Manufacturer: PUOLOP(迪浦); Manufacturer Part: AMS1117-3.3; JLCPCB Part Class: Extended Part; link: https://so.szlcsc.com/global.html?k=C351784&ref=editor
U3 = VRB0505S-5WR3: Supplier: LCSC; Supplier Part: C5189717; Manufacturer: MORNSUN(金升阳); JLCPCB Part Class: Extended Part; Contributor: lcsc; link: https://so.szlcsc.com/global.html?k=C5189717&ref=editor
U4 = B0505S-3WR2: Contributor: LCSC; Supplier: LCSC; Supplier Part: C503943; Manufacturer: MORNSUN(金升阳); JLCPCB Part Class: Extended Part; link: https://so.szlcsc.com/global.html?k=C503943&ref=editor
H1 = X6521WR-2×25H-C30D60: Contributor: LCSC; Supplier: LCSC; Supplier Part: C725937; Manufacturer: XKB Connection(中国星坤); Manufacturer Part: X6521WR-2x25H-C60D30; JLCPCB Part Class: Extended Part; link: https://so.szlcsc.com/global.html?k=C725937&ref=editor
U7 = VGAS-C: Supplier: LCSC; Supplier Part: C9900021148; Manufacturer: null; Contributor: Denjhang; JLCPCB Part Class: Extended Part

## Nets
2V5: AC1.63(VDD2.5) R3.2 U1.4
2v5: C20.2 R37.1 R38.2 U8.3(IN1+) U8.5(IN2+)
3V3: AC1.14(VDD3.3) AC1.48(VDD3.3) AC1.78(VDD3.3) AC1.106(VDD3.3) C3.1 C5.2 CARD1.4(VDD) H1.27 MD1.5 MD2.5 R2.2 R5.2 R6.2 R7.2 RN1.1 RN1.2 RN1.3 RN1.4 RN2.1 RN2.2 RN2.3 RN2.4 U2.2(VOUT) U2.4(TAB)
5V: C2.2 C4.1 H1.50 JP1.5 JP2.5 L1.1 L2.2 R1.2 R13.2 U2.3(VIN) U3.6(+Vo) U4.6(+VO)
5V-VGA: R13.1 U7.9
GND: AC1.15(GND) AC1.49(GND) AC1.73(GND) AC1.79(GND) AC1.107(GND) C2.1 C3.2 C4.2 C5.1 C10.1 C14.1 C19.1 C20.1 CARD1.6(VSS) CARD1.10 CARD1.11 CARD1.12 CARD1.13 CARD1.CD CN1.3 H1.49 JP1.9 JP2.9 LED1.2 LED2.2 LED3.2 MD1.3 MD2.3 R4.2 R10.1 R38.1 RV1.1 RV1.4 SW2.1 SW2.2 SW2.3 SW2.4 SW2.5 SW2.6 SW2.7 SW2.8 U1.2 U1.10 U2.1(GND) U3.7(0V) U4.4(0V) U5.1 U6.1 U7.5 U7.7 U7.8 U7.10 U8.4(VCC-/GND)
GND-DC: C1.2 DC1.2 DC1.3 R4.1 U3.1(GND) U4.2(GND)
A.VCC: C10.2 L1.2 R37.2 U8.8(VCC+)
btn_n_i[1]-I_B8: AC1.47(I_B8) R5.1 U5.2
btn_n_i[2]-I_E1: AC1.50(I_E1) R6.1 U6.2
dac_l_o-IO_P16: AC1.5(IO_P16) C11.1
dac_r_o-IO_P15: AC1.4(IO_P15) C16.1
DC-IN: C1.1 FUSE1.2 SW1.3(5) SW1.4(2)
DC-IN2: L2.1 SW1.1 SW1.2(4) U3.2(Vin) U4.1(VIN)
dip_i[1]-R9: AC1.114(I_R9) RN1.8 SW2.16
dip_i[2]-I_T9: AC1.115(I_T9) RN1.7 SW2.15
dip_i[3]-I_M15: AC1.8(I_M15) RN1.6 SW2.14
dip_i[4]-I_M16: AC1.9(I_M16) RN1.5 SW2.13
dip_i[5]-I_E16: AC1.29(I_E16) RN2.8 SW2.12
dip_i[6]-I_A8: AC1.45(I_A8) RN2.7 SW2.11
dip_i[7]-I_B9: AC1.43(I_B9) RN2.6 SW2.10
dip_i[8]-I_A9: AC1.42(I_A9) RN2.5 SW2.9
esp_rx_o-IO_L14: AC1.23(IO_L14) H1.2
esp_tx_i-IO_J15: AC1.21(IO_J15) H1.4
joy1_down_io-IO_N12: AC1.16(IO_N12) RN3.6
joy1_left_io-IO_N14: AC1.18(IO_N14) RN3.7
joy1_p6_io-IO_N11: AC1.13(IO_N11) RN4.3
joy1_p7_io-IO_P14: AC1.17(IO_P14) RN4.2
joy1_p8_io-IO_L13: AC1.19(IO_L13) RN4.1
joy1_right_io-IO_K16: AC1.20(IO_K16) RN3.8
joy1_up_io-IO_P11: AC1.12(IO_P11) RN3.5
joy2_down_io-IO_F16: AC1.26(IO_F16) RN5.6
joy2_left_io-IO_F15: AC1.28(IO_F15) RN5.7
joy2_p6_io-IO_K15: AC1.25(IO_K15) RN6.3
joy2_p7_io-IO_G15: AC1.27(IO_G15) RN6.2
joy2_p8_io-IO_D16: AC1.30(IO_D16) RN6.1
joy2_right_io-IO_D15: AC1.31(IO_D15) RN5.8
joy2_up_io-IO_J14: AC1.24(IO_J14) RN5.5
OUT.L: C13.2 CN1.4
OUT.R: C18.2 CN1.2
ps2_clk_io-IO_L16: AC1.11(IO_L16) R12.1
ps2_data_io-IO_L15: AC1.10(IO_L15) R11.1
ps2_mouse_clk_io-IO_N15: AC1.6(IO_N15) R9.1
ps2_mouse_data_io-IO_N16: AC1.7(IO_N16) R8.1
sd_cs_n_o-IO_G16: AC1.36(IO_G16) CARD1.2(CD/DAT3)
sd_miso_i-IO_C15: AC1.33(IO_C15) CARD1.7(DAT0)
sd_mosi_o-IO_J13: AC1.35(IO_J13) CARD1.3(CMD)
sd_sclk_o-IO_B16: AC1.34(IO_B16) CARD1.5(CLX)
sd_sw_i-IO_C16: AC1.32(IO_C16) R7.1 R10.2
slot_A_o[0]-IO_P8: AC1.80(IO_P8) H1.28
slot_A_o[1]-IO_L7: AC1.71(IO_L7) H1.21
slot_A_o[2]-IO_N8: AC1.81(IO_N8) H1.29
slot_A_o[3]-IO_P6: AC1.75(IO_P6) H1.30
slot_A_o[4]-IO_N9: AC1.83(IO_N9) H1.33
slot_A_o[5]-IO_M8: AC1.77(IO_M8) H1.34
slot_A_o[6]-IO_P3: AC1.70(IO_P3) H1.19
slot_A_o[7]-IO_K5: AC1.65(IO_K5) H1.20
slot_A_o[8]-IO_N6: AC1.72(IO_N6) H1.23
slot_A_o[9]-IO_G5: AC1.57(IO_G5) H1.13
slot_A_o[10]-IO_N3: AC1.68(IO_N3) H1.25
slot_A_o[11]-IO_G1: AC1.59(IO_G1) H1.26
slot_A_o[12]-IO_M6: AC1.67(IO_M6) H1.24
slot_A_o[13]-IO_M7: AC1.76(IO_M7) H1.32
slot_A_o[14]-IO_N5: AC1.69(IO_N5) H1.17
slot_A_o[15]-IO_L4: AC1.66(IO_L4) H1.22
slot_BUSDIR_i-IO_F8: AC1.37(IO_F8) H1.18
slot_CLOCK_o-IO_T3: AC1.101(IO_T3) H1.46
slot_CS1_o-IO_E11: AC1.41(IO_E11) H1.10
slot_CS2_o-IO_F9: AC1.40(IO_F9) H1.12
slot_CS12_o-IO_C9: AC1.44(IO_C9) H1.6
slot_D_io[0]-LVDS_TX1_P: AC1.87(LVDS_TX1_P) H1.36
slot_D_io[1]-IO_P9: AC1.84(IO_P9) H1.35
slot_D_io[2]-IO_R1: AC1.98(IO_R1) H1.45
slot_D_io[3]-LVDS_TX5_N: AC1.96(LVDS_TX5_N) H1.41
slot_D_io[4]-IO_R3: AC1.100(IO_R3) H1.48
slot_D_io[5]-LVDS_TX5_P: AC1.97(LVDS_TX5_P) H1.43
slot_D_io[6]-IO_R4: AC1.102(IO_R4) H1.44
slot_D_io[7]-IO_T2: AC1.99(IO_T2) H1.47
slot_DATA_DIR_o-IO_L8: AC1.82(IO_L8) H1.31
slot_DATA_OE_o-IO_M10: AC1.85(IO_M10) H1.37
slot_INT_i-IO_F14: AC1.39(IO_F14) H1.14
slot_IOREQ_o-IO_F1: AC1.56(IO_F1) H1.11
slot_M1_o-IO_F2: AC1.55(IO_F2) H1.9
slot_MREQ_o-IO_D1: AC1.53(IO_D1) H1.5
slot_RD_o-IO_F3: AC1.54(IO_F3) H1.7
slot_RESET_io-IO_J16: AC1.22(IO_J16) H1.39
slot_RFSH_i-IO_B1: AC1.51(IO_B1) H1.1
slot_SLOT1_o-IO_C2: AC1.52(IO_C2) H1.3
slot_SLOT2_o-IO_D9: AC1.46(IO_D9) H1.8
slot_SLOT3_o-IO_F13: AC1.38(IO_F13) H1.16
slot_SW1_io-IO_T4: AC1.103(IO_T4) H1.42 R39.2
slot_SW2_io-IO_R5: AC1.104(IO_R5) H1.40 R39.1
slot_WAIT_i-LVDS_TX1_N: AC1.86(LVDS_TX1_N) H1.38
slot_WR_o-IO_G2: AC1.58(IO_G2) H1.15
Sound-IN: R32.1 R34.1
TCK: AC1.60(TCK) U1.1
TDI: AC1.61(TDI) U1.9
TDO: AC1.64(TDO) U1.3
TMS: AC1.62(TMS) U1.5
VBX: C8.2 U7.3
vga_b_o[0]-IO_T10: AC1.117(IO_T10) R30.2
vga_b_o[1]-IO_R10: AC1.116(IO_R10) R29.2
vga_b_o[2]-IO_T7: AC1.111(IO_T7) R28.2
vga_b_o[3]-IO_R7: AC1.110(IO_R7) R27.2
vga_b_o[4]-IO_T6: AC1.109(IO_T6) R26.2
vga_g_o[0]-IO_R13: AC1.122(IO_R13) R18.2
vga_g_o[1]-IO_T12: AC1.121(IO_T12) R17.2
vga_g_o[2]-IO_R12: AC1.120(IO_R12) R16.2
vga_g_o[3]-IO_T11: AC1.119(IO_T11) R15.2
vga_g_o[4]-IO_R11: AC1.118(IO_R11) R14.2
vga_hsync_n_o-IO_T5: AC1.105(IO_T5) R20.1
vga_r_o[0]-IO_R16: AC1.3(IO_R16) R25.2
vga_r_o[1]-IO_T15: AC1.2(IO_T15) R24.2
vga_r_o[2]-IO_T14: AC1.1(IO_T14) R22.2
vga_r_o[3]-IO_R14: AC1.124(IO_R14) R21.2
vga_r_o[4]-IO_T13: AC1.123(IO_T13) R19.2
vga_vsync_n_o-IO_R6: AC1.108(IO_R6) R23.1
VGX: C6.2 U7.2
VRX: C7.2 U7.1
Net-(C6-1): C6.1 R14.1 R15.1 R16.1 R17.1 R18.1
Net-(C7-1): C7.1 R19.1 R21.1 R22.1 R24.1 R25.1
Net-(C8-1): C8.1 R26.1 R27.1 R28.1 R29.1 R30.1
Net-(C9-1): C9.1 R31.1 R32.2 R33.2 U8.2(IN1-)
Net-(C9-2): C9.2 C12.1 R31.2 U8.1(OUT1)
Net-(C11-2): C11.2 C14.2 R33.1
Net-(C12-2): C12.2 RV1.3
Net-(C13-1): C13.1 RV1.2
Net-(C15-1): C15.1 R34.2 R35.1 R36.2 U8.6(IN2-)
Net-(C15-2): C15.2 C17.1 R35.2 U8.7(OUT2)
Net-(C16-2): C16.2 C19.2 R36.1
Net-(C17-2): C17.2 RV1.6
Net-(C18-1): C18.1 RV1.5
Net-(DC1-1): DC1.1 FUSE1.1
Net-(JP1-1): JP1.1 RN3.4
Net-(JP1-2): JP1.2 RN3.3
Net-(JP1-3): JP1.3 RN3.2
Net-(JP1-4): JP1.4 RN3.1
Net-(JP1-6): JP1.6 RN4.6
Net-(JP1-7): JP1.7 RN4.7
Net-(JP1-8): JP1.8 RN4.8
Net-(JP2-1): JP2.1 RN5.4
Net-(JP2-2): JP2.2 RN5.3
Net-(JP2-3): JP2.3 RN5.2
Net-(JP2-4): JP2.4 RN5.1
Net-(JP2-6): JP2.6 RN6.6
Net-(JP2-7): JP2.7 RN6.7
Net-(JP2-8): JP2.8 RN6.8
Net-(LED1-1): LED1.1 R1.1
Net-(LED2-1): LED2.1 R2.1
Net-(LED3-1): LED3.1 R3.1
Net-(MD1-1): MD1.1 R8.2
Net-(MD1-6): MD1.6 R9.2
Net-(MD2-1): MD2.1 R11.2
Net-(MD2-6): MD2.6 R12.2
Net-(R20-2): R20.2 U7.13
Net-(R23-2): R23.2 U7.14

Not connected (* = marked no-connect by the designer): AC1 74(VDD1.2)* 88(LVDS_TX2_N)* 89(LVDS_TX2_P)* 90(LVDS_TX3_N)* 91(LVDS_TX3_P)* 92(LVDS_RXCLK_N)* 93(LVDS_RXCLK_P)* 94(LVDS_TX4_N)* 95(LVDS_TX4_P)* 112(I_R8)* 113(I_T8)*; CARD1 1(DAT2)* 8(DAT1)*; MD1 2* 8* SH1(PE1)* SH2(PE2)* SH3(PE3)*; MD2 2* 8* SH1(PE1)* SH2(PE2)* SH3(PE3)*; RN4 4* 5*; RN6 4* 5*; SW1 5(3)* 6* 7* 8*; U1 6* 7* 8*; U3 3(NC)* 5(NC)* 8(NC)*; U5 3* 4*; U6 3* 4*; U7 0* 4* 6* 11* 12 15

## Notes on the sheets
sheet 1
- 2024.3.31
- 1.改开关线路，按下开机
- 2.加核心音频直流耦合电容
- 3.修正VGA接线
- 4.添加VGA电解电容
- 5.修正短接电源模块线路
sheet 2
- 开关设计错误，符号封装错误,已修正
- 也可以使用VRB0505-6W但是贵
- 不使用隔离模块时短路原边和副边
- 短接致命错误，已修正
sheet 3
- 已改mini2
- 已改mini2
- 已改mini2
- 不知道如何接，之前的图都是悬空
- 忽略EAR功能，根本不用
- 已改mini2
- 已改mini2
sheet 4
- 搞笑错误：VR和VG接反了，已修正
- 已改mini2
- 已改mini2
sheet 5
- 反馈电阻用160k
- 音频输入
- PJ-320B苗条的耳机孔
- 搞笑错误：遗漏4.7u耦合电容，导致没声音，已修正
- 已改mini2
sheet 6
- wifi模块走卡槽
- 兼容Mini1卡槽
- 已改mini2
